# Altium schematic sheet 1-AT-Llink-EZ.schdoc
size 307 x 205 mm
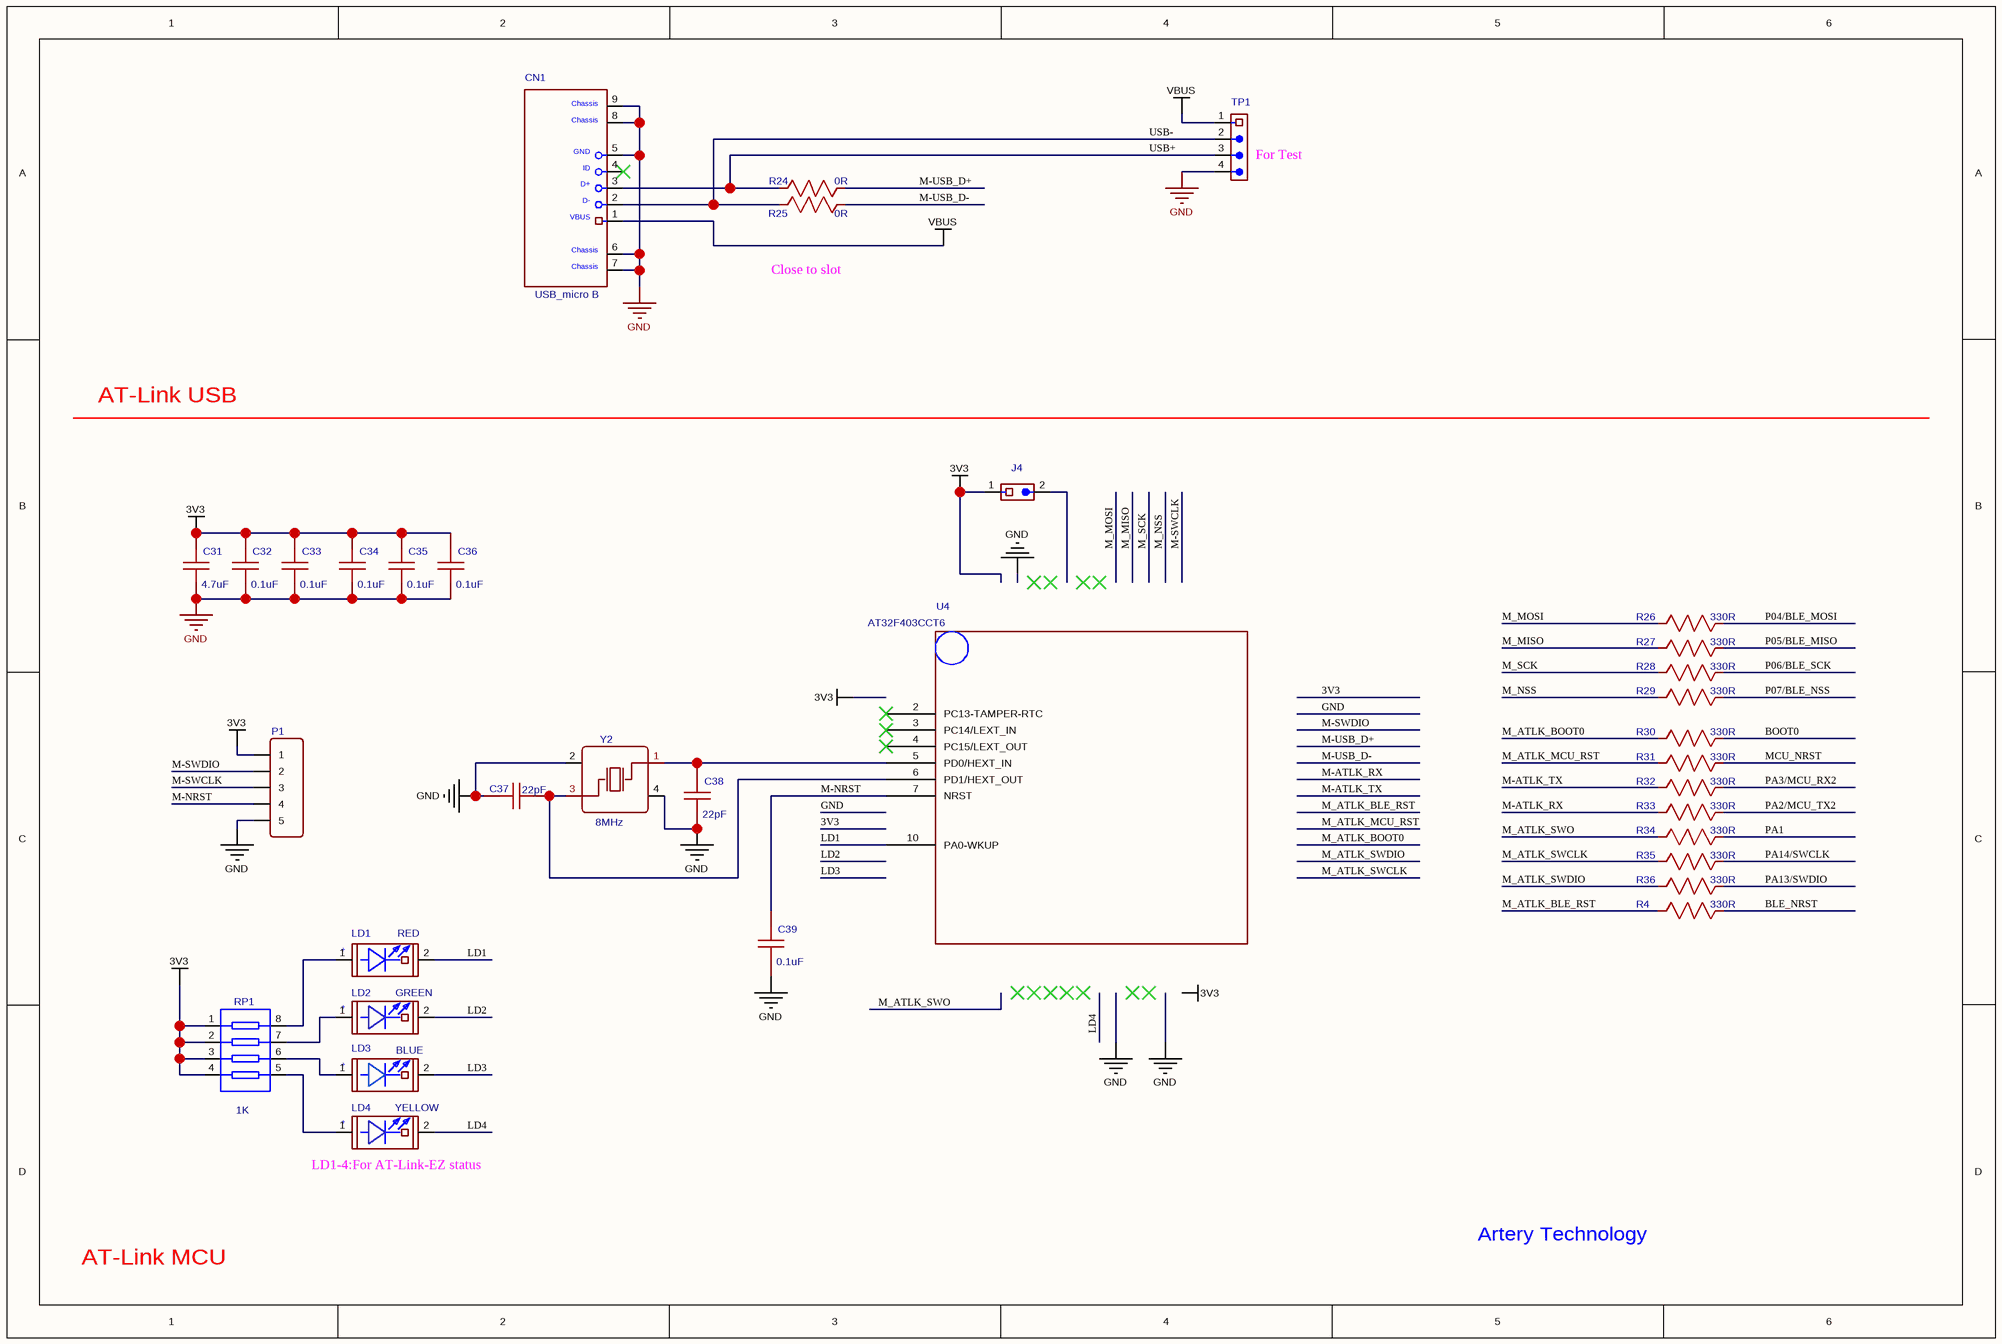
[diagram p0: 1-AT-Llink-EZ.schdoc]

## Parts
C31  4.7uF  [0603_C-M]
C32  0.1uF  [0603_C-M]
C33  0.1uF  [0603_C-M]
C34  0.1uF  [0603_C-M]
C35  0.1uF  [0603_C-M]
C36  0.1uF  [0603_C-M]
C37  22pF  [0603_C-M]
C38  22pF  [0603_C-M]
C39  0.1uF  [0603_C-M]
CN1  USB_micro B  [USB_MIC_DIP]
J4  1X2P,Male,DIP_2.54  [HDR1X2]  (value not drawn)
LD1  RED  [LED0603]
LD2  GREEN  [LED0603]
LD3  BLUE  [LED0603]
LD4  YELLOW  [LED0603]
P1  HDR-M-2.54_1x5  [HDR-M-2.54_1X5]  (value not drawn)
R4  330R  [0603_R-M]
R24  0R  [0603_R-M]
R25  0R  [0603_R-M]
R26  330R  [0603_R-M]
R27  330R  [0603_R-M]
R28  330R  [0603_R-M]
R29  330R  [0603_R-M]
R30  330R  [0603_R-M]
R31  330R  [0603_R-M]
R32  330R  [0603_R-M]
R33  330R  [0603_R-M]
R34  330R  [0603_R-M]
R35  330R  [0603_R-M]
R36  330R  [0603_R-M]
RP1  1K  [0603*4,8P4R]
TP1  1X4P_2.54F  [HDR1X4 - TOP]  (value not drawn)
U4  AT32F403CCT6  [LQFP48 - 2]
Y2  8MHz  [OSC-SMD_4P-L5.0-W3.2-BL]

## Nets
3V3: C31.1 C32.1 C33.1 C34.1 C35.1 C36.1 J4.1 P1.1 RP1.1 RP1.2 RP1.3 RP1.4
GND: C31.2 C32.2 C33.2 C34.2 C35.2 C36.2 C37.1 C38.2 C39.2 CN1.5(GND) CN1.6 CN1.7 CN1.8 CN1.9 P1.5 TP1.4 Y2.2(GND) Y2.4(GND)
VBUS: CN1.1(VBUS) TP1.1
BLE_NRST: R4.1
BOOT0: R30.1
LD1: LD1.2(CATHODE) U4.10(PA0-WKUP)
LD2: LD2.2(CATHODE)
LD3: LD3.2(CATHODE)
LD4: LD4.2(CATHODE)
M-ATLK_RX: R33.2
M-ATLK_TX: R32.2
M-NRST: C39.1 P1.4 U4.7(NRST)
M-SWCLK: P1.3
M-SWDIO: P1.2
M-USB_D+: R24.2
M-USB_D-: R25.2
M_ATLK_BLE_RST: R4.2
M_ATLK_BOOT0: R30.2
M_ATLK_MCU_RST: R31.2
M_ATLK_SWCLK: R35.2
M_ATLK_SWDIO: R36.2
M_ATLK_SWO: R34.2
M_MISO: R27.2
M_MOSI: R26.2
M_NSS: R29.2
M_SCK: R28.2
MCU_NRST: R31.1
P04/BLE_MOSI: R26.1
P05/BLE_MISO: R27.1
P06/BLE_SCK: R28.1
P07/BLE_NSS: R29.1
PA1: R34.1
PA2/MCU_TX2: R33.1
PA3/MCU_RX2: R32.1
PA13/SWDIO: R36.1
PA14/SWCLK: R35.1
USB+: CN1.3(D+) R24.1 TP1.3
USB-: CN1.2(D-) R25.1 TP1.2
NetC37_2: C37.2 U4.6(PD1/HEXT_OUT) Y2.3(OSC2)
NetC38_1: C38.1 U4.5(PD0/HEXT_IN) Y2.1(OSC1)
NetLD1_1: LD1.1(ANODE) RP1.8
NetLD2_1: LD2.1(ANODE) RP1.7
NetLD3_1: LD3.1(ANODE) RP1.6
NetLD4_1: LD4.1(ANODE) RP1.5

Not connected (* = marked no-connect by the designer): CN1 4(ID)*; J4 2; U4 2(PC13-TAMPER-RTC)* 3(PC14/LEXT_IN)* 4(PC15/LEXT_OUT)*

## Notes on the sheet
- (near TP1) For Test
- Close to slot
- AT-Link USB
- (near LD4) LD1-4:For AT-Link-EZ status
- AT-Link MCU
- Artery Technology
- Labels drawn without touching a wire or pin: 3V3
- (in symbol BLUE) +
- (in symbol GREEN) +
- (in symbol RED) +
- (in symbol USB_micro B) Chassis
- (in symbol YELLOW) +

## Library data of the parts
C31 = 4.7uF: nameAlias: Value(F); Contributor: LCEDA_Lib; spicePre: C; spiceSymbolName: C_0603_US
C32-C36 C39 = 0.1uF: nameAlias: Value(F); Contributor: LCEDA_Lib; spicePre: C; spiceSymbolName: C_0603_US
C37 C38 = 22pF: nameAlias: Value(F); Contributor: LCEDA_Lib; spicePre: C; spiceSymbolName: C_0603_US
J4 = 1X2P,Male,DIP_2.54: Contributor: twb17; spicePre: J; spiceSymbolName: 1X2P,Male,DIP_2.54
P1 = HDR-M-2.54_1x5: Contributor: LCEDA_Lib; BOM_Supplier Part: C358687; BOM_Supplier: LCSC; spicePre: J; spiceSymbolName: HDR-M-2.54_1x5
R4 R26-R36 = 330R: nameAlias: Value(Ω); Contributor: LCEDA_Lib; spicePre: R; spiceSymbolName: R_0603_US
R24 R25 = 0R: nameAlias: Value(Ω); Contributor: LCEDA_Lib; spicePre: R; spiceSymbolName: R_0603_US
RP1 = 1K: Contributor: twb17; spicePre: R; spiceSymbolName: RES_0603*4
Y2 = 8MHz: BOM_Manufacturer: TAE; BOM_Manufacturer Part: SMD-5032_4P8M20pf20ppm; nameAlias: Frequency; Contributor: LCSC; BOM_Paste Type: recommend; BOM_Supplier: LCSC; BOM_Supplier Part: C133333; spicePre: X; spiceSymbolName: SMD-5032_4P8M20PF20PPM